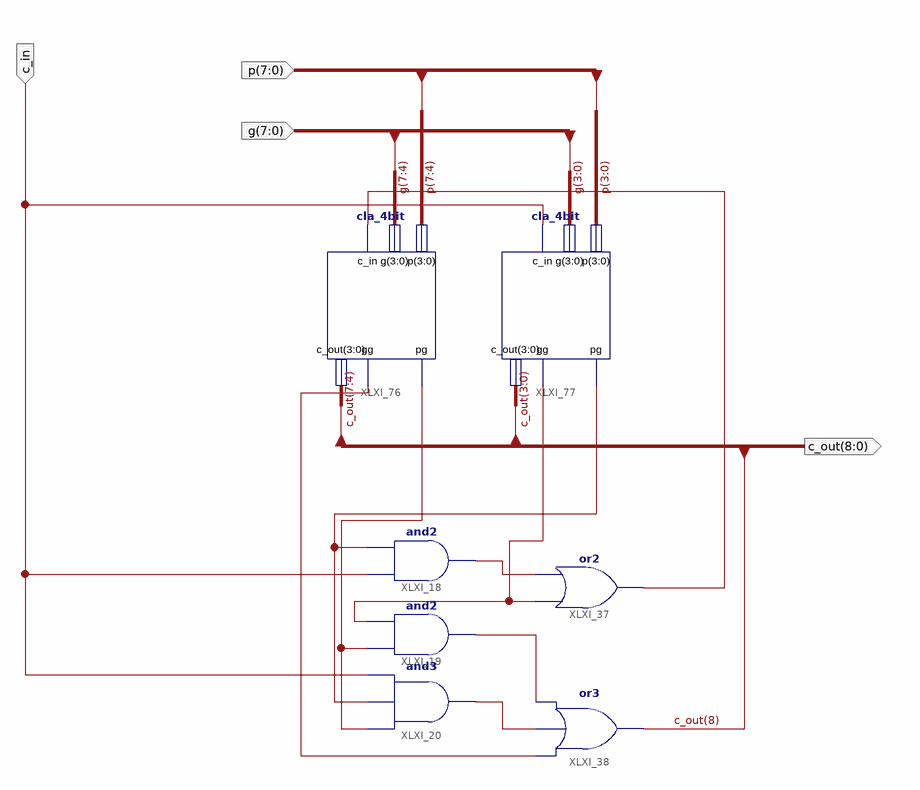
[diagram p0: schematic sheet 1]
// Xilinx ISE schematic cla_8bit.sch (spartan3e) as structural Verilog: 7 symbols, 4 ports
module cla_8bit (
  input  c_in,
  input  [7:0] p,
  input  [7:0] g,
  output [8:0] c_out
);

  wire XLXN_28, XLXN_29, XLXN_34, XLXN_143, XLXN_146, XLXN_147, XLXN_148, XLXN_149;

  or XLXI_38 (c_out[8], XLXN_147, XLXN_34, XLXN_29);
  or XLXI_37 (XLXN_143, XLXN_148, XLXN_28);
  and XLXI_18 (XLXN_28, c_in, XLXN_146);
  and XLXI_20 (XLXN_34, XLXN_149, XLXN_146, c_in);
  and XLXI_19 (XLXN_29, XLXN_149, XLXN_148);
  cla_4bit XLXI_76 (.p(p[7:4]), .g(g[7:4]), .c_in(XLXN_143), .pg(XLXN_149), .gg(XLXN_147), .c_out(c_out[7:4]));
  cla_4bit XLXI_77 (.p(p[3:0]), .g(g[3:0]), .c_in(c_in), .pg(XLXN_146), .gg(XLXN_148), .c_out(c_out[3:0]));
endmodule
